# Altium schematic sheet IO&USB_Interface_Module.SchDoc: IO&USB Interface Module
size A4
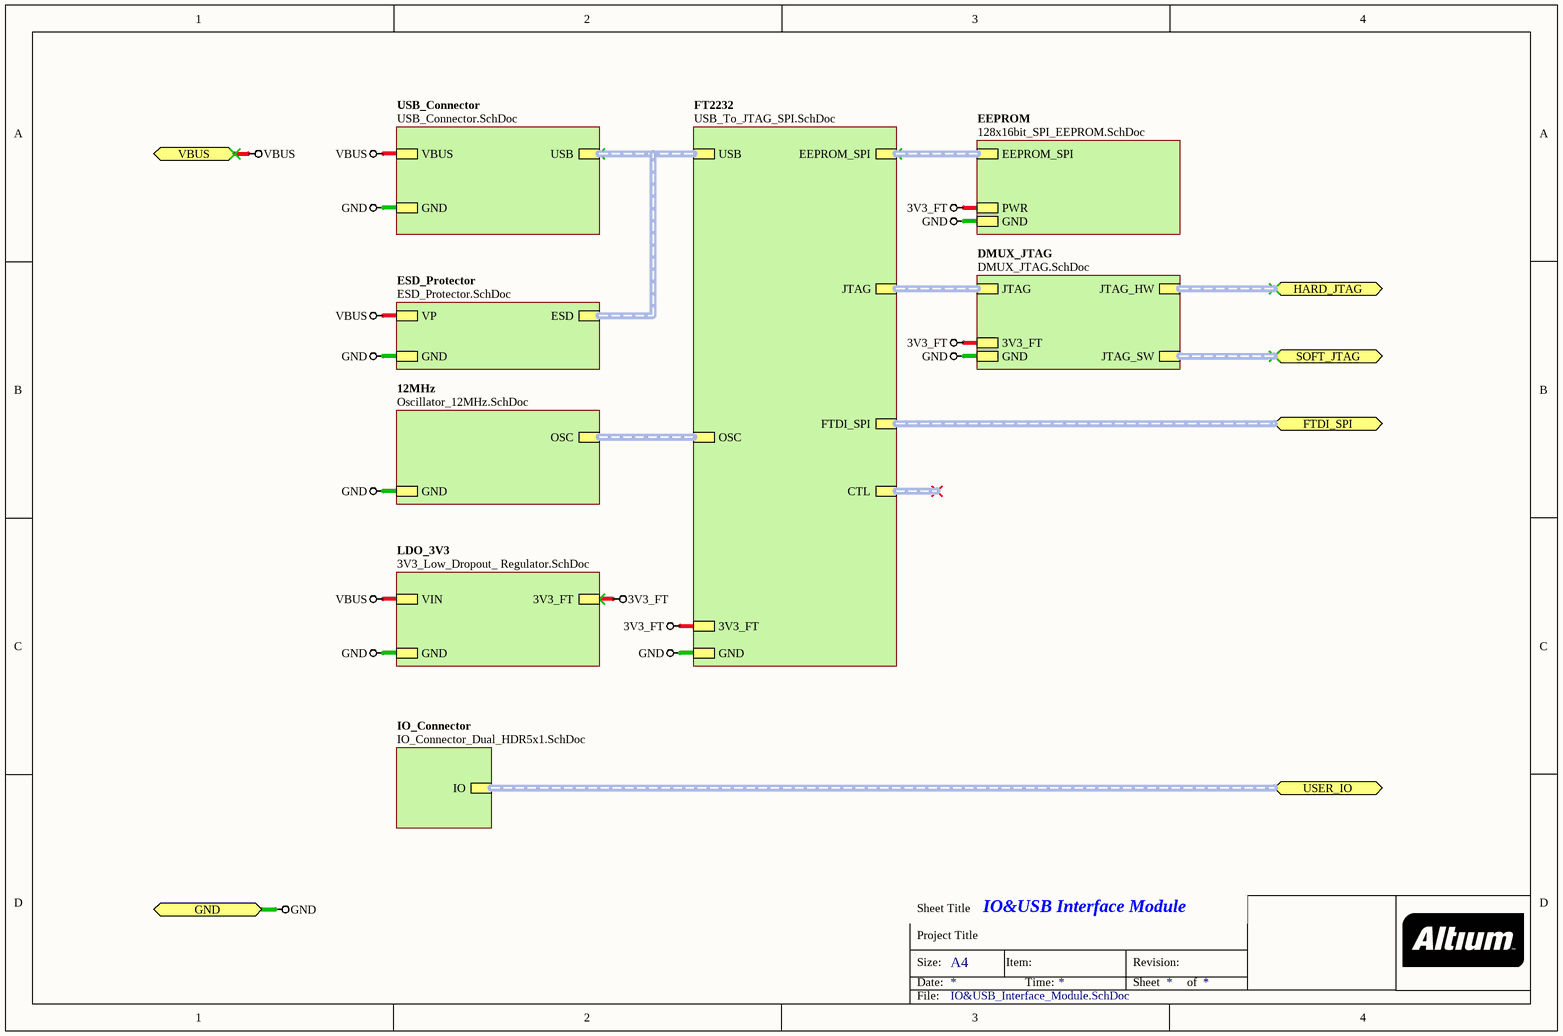
[diagram p0: IO&USB_Interface_Module.SchDoc]

## Sub-sheets
12MHz = Oscillator_12MHz.SchDoc: OSC (harness OSC), GND
DMUX_JTAG = DMUX_JTAG.SchDoc: JTAG_SW (harness JTAG_SW), JTAG_HW (harness JTAG_HW), GND, 3V3_FT, JTAG (harness JTAG)
EEPROM = 128x16bit_SPI_EEPROM.SchDoc: EEPROM_SPI (harness FTDI_SPI), GND, PWR
ESD_Protector = ESD_Protector.SchDoc: VP, GND, ESD (harness USB)
FT2232 = USB_To_JTAG_SPI.SchDoc: USB (harness USB), EEPROM_SPI (harness EEPROM_SPI), 3V3_FT, GND, OSC (harness OSC), FTDI_SPI (harness FTDI_SPI), JTAG (harness JTAG), CTL (harness CTL)
IO_Connector = IO_Connector_Dual_HDR5x1.SchDoc: IO (harness SIG10)
LDO_3V3 = 3V3_Low_Dropout_ Regulator.SchDoc: 3V3_FT, VIN, GND
USB_Connector = USB_Connector.SchDoc: VBUS, GND, USB (harness USB)

## Ports
FTDI_SPI (harness FTDI_SPI), GND, HARD_JTAG (harness JTAG_A), SOFT_JTAG (harness JTAG_A), USER_IO (harness SIG10), VBUS

## Nets
3V3_FT: sheet FT2232/3V3_FT, sheet DMUX_JTAG/3V3_FT, sheet EEPROM/PWR, sheet LDO_3V3/3V3_FT
GND: port GND, sheet FT2232/GND, sheet 12MHz/GND, sheet DMUX_JTAG/GND, sheet EEPROM/GND, sheet LDO_3V3/GND, sheet USB_Connector/GND, sheet ESD_Protector/GND
VBUS: port VBUS, sheet LDO_3V3/VIN, sheet USB_Connector/VBUS, sheet ESD_Protector/VP

## Buses and harness runs
harness port FTDI_SPI = sheet FT2232/FTDI_SPI
harness port HARD_JTAG = sheet DMUX_JTAG/JTAG_HW
harness port SOFT_JTAG = sheet DMUX_JTAG/JTAG_SW
harness port USER_IO = sheet IO_Connector/IO
harness sheet 12MHz/OSC = sheet FT2232/OSC
harness sheet DMUX_JTAG/JTAG = sheet FT2232/JTAG
harness sheet EEPROM/EEPROM_SPI = sheet FT2232/EEPROM_SPI
harness sheet ESD_Protector/ESD = sheet FT2232/USB = sheet USB_Connector/USB

## Notes on the sheet
- Sheet Title
- Project Title
- Size:
- Date:
- A4
- Item:
- Time:
- Revision:
- Sheet
- of
- File: